# EAGLE schematic PWM (EAGLE 6.2)

## Sheet 1 of 3
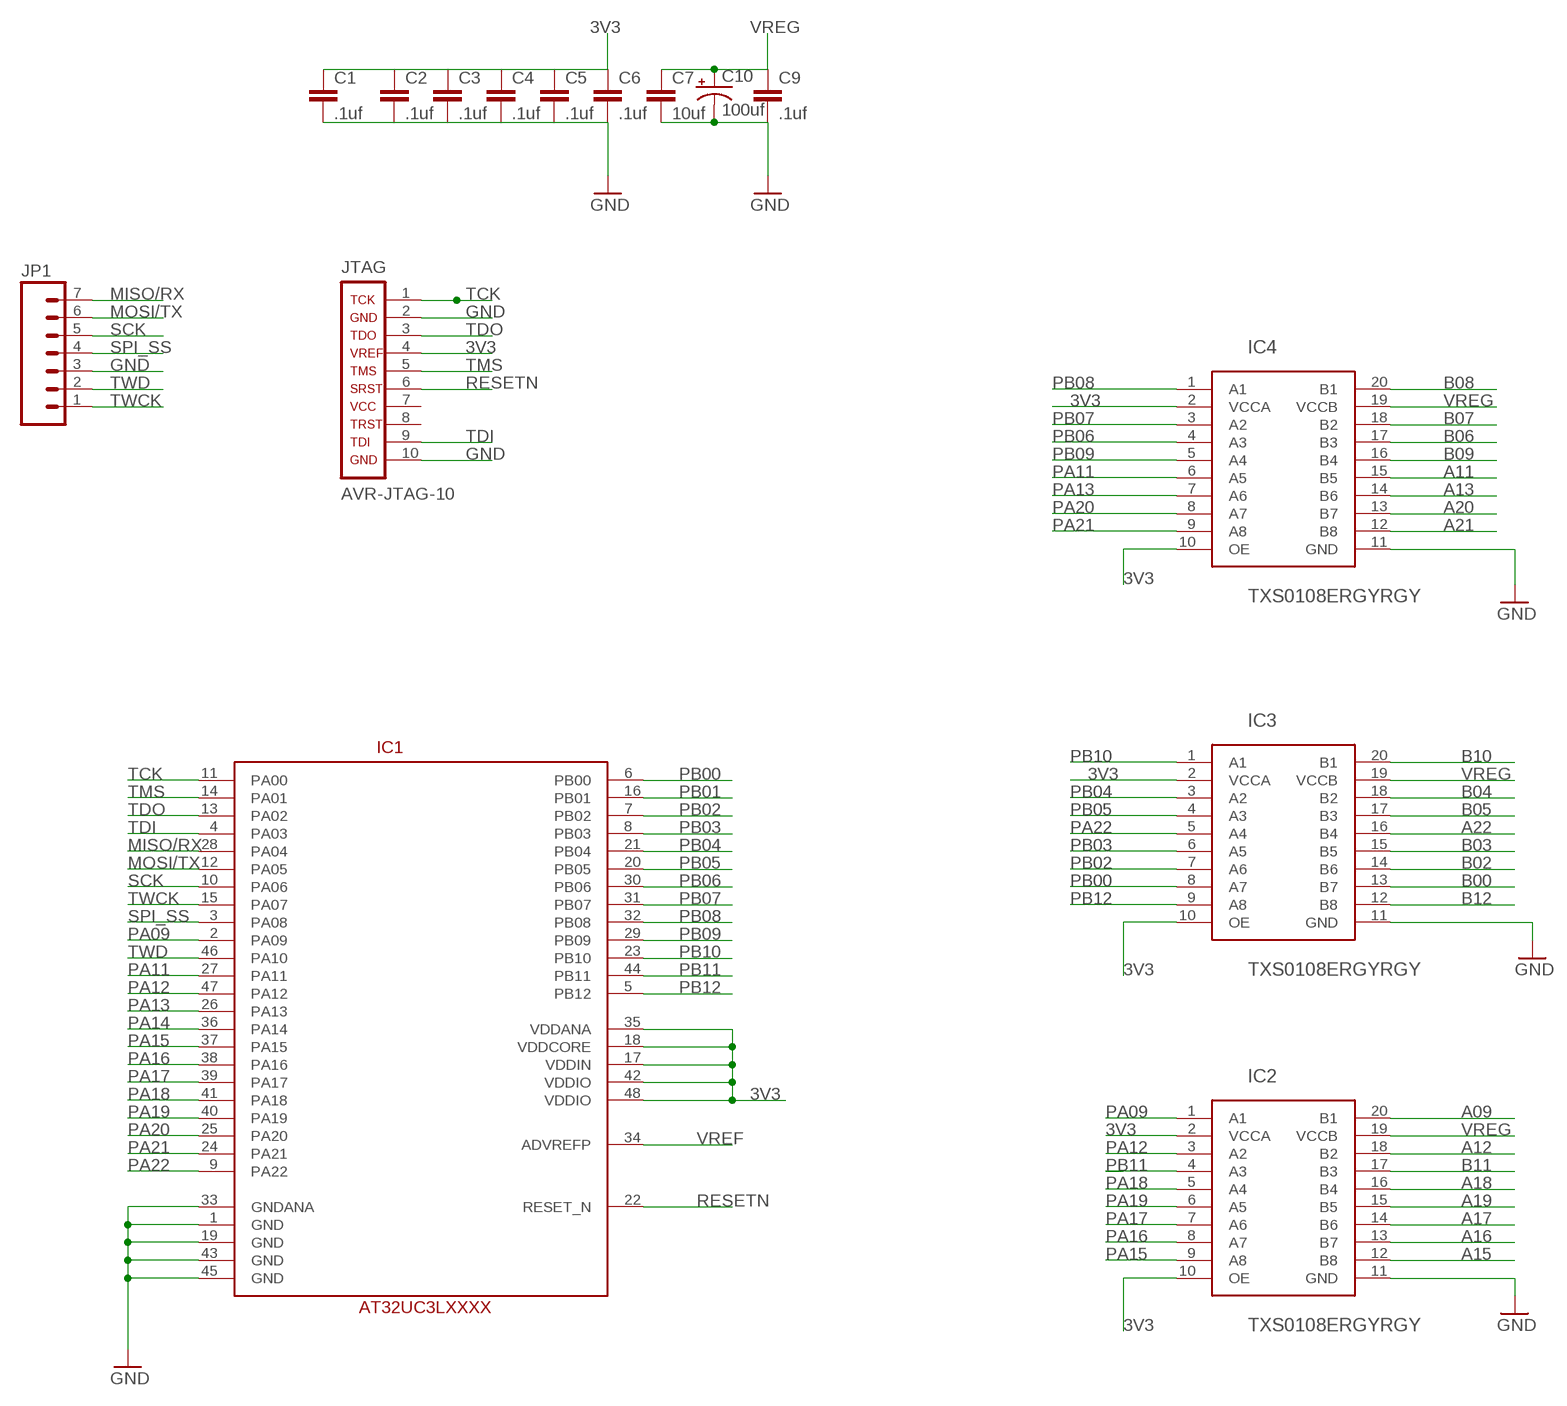
[diagram p0: schematic, sheet 1]

### Parts
C1  .1uf  CAP0805  [0805]
C2  .1uf  CAP0805  [0805]
C3  .1uf  CAP0805  [0805]
C4  .1uf  CAP0805  [0805]
C5  .1uf  CAP0805  [0805]
C6  .1uf  CAP0805  [0805]
C7  10uf  CAP0805  [0805]
C9  .1uf  CAP0805  [0805]
C10  100uf  CAP_POL7343  [EIA7343]
IC1  AT32UC3L016/32/64  [TQFP48]
IC2  TXS0108ERGYRGY  [RGY]
IC3  TXS0108ERGYRGY  [RGY]
IC4  TXS0108ERGYRGY  [RGY]
JP1  M07  [1X07]
JTAG  AVR-JTAG-10  [AVR-JTAG-10]

### Nets
3V3: C1.1 C2.1 C3.1 C4.1 C5.1 C6.1 IC1.17(VDDIN) IC1.18(VDDCORE) IC1.35(VDDANA) IC1.42(VDDIO) IC1.48(VDDIO) IC2.2(VCCA) IC2.10(OE) IC3.2(VCCA) IC3.10(OE) IC4.2(VCCA) IC4.10(OE) JTAG.4 ; also sheet 3
A09: IC2.20(B1) ; also sheet 2
A11: IC4.15(B5) ; also sheet 2
A12: IC2.18(B2) ; also sheet 2
A13: IC4.14(B6) ; also sheet 2
A15: IC2.12(B8) ; also sheet 2
A16: IC2.13(B7) ; also sheet 2
A17: IC2.14(B6) ; also sheet 2
A18: IC2.16(B4) ; also sheet 2
A19: IC2.15(B5) ; also sheet 2
A20: IC4.13(B7) ; also sheet 2
A21: IC4.12(B8) ; also sheet 2
A22: IC3.16(B4) ; also sheet 2
B00: IC3.13(B7) ; also sheet 2
B02: IC3.14(B6) ; also sheet 2
B03: IC3.15(B5) ; also sheet 2
B04: IC3.18(B2) ; also sheet 2
B05: IC3.17(B3) ; also sheet 2
B06: IC4.17(B3) ; also sheet 2
B07: IC4.18(B2) ; also sheet 2
B08: IC4.20(B1) ; also sheet 2
B09: IC4.16(B4) ; also sheet 2
B10: IC3.20(B1) ; also sheet 2
B11: IC2.17(B3) ; also sheet 2
B12: IC3.12(B8) ; also sheet 2
GND: C1.2 C2.2 C3.2 C4.2 C5.2 C6.2 C7.2 C9.2 C10.C(-) IC1.1(GND) IC1.19(GND) IC1.33(GNDANA) IC1.43(GND) IC1.45(GND) IC2.11(GND) IC3.11(GND) IC4.11(GND) JP1.3 JTAG.2 JTAG.10 ; also sheet 2,3
MISO/RX: IC1.28(PA04) JP1.7
MOSI/TX: IC1.12(PA05) JP1.6
PA09: IC1.2(PA09) IC2.1(A1)
PA11: IC1.27(PA11) IC4.6(A5)
PA12: IC1.47(PA12) IC2.3(A2)
PA13: IC1.26(PA13) IC4.7(A6)
PA14: IC1.36(PA14)
PA15: IC1.37(PA15) IC2.9(A8)
PA16: IC1.38(PA16) IC2.8(A7)
PA17: IC1.39(PA17) IC2.7(A6)
PA18: IC1.41(PA18) IC2.5(A4)
PA19: IC1.40(PA19) IC2.6(A5)
PA20: IC1.25(PA20) IC4.8(A7)
PA21: IC1.24(PA21) IC4.9(A8)
PA22: IC1.9(PA22) IC3.5(A4)
PB00: IC1.6(PB00) IC3.8(A7)
PB01: IC1.16(PB01)
PB02: IC1.7(PB02) IC3.7(A6)
PB03: IC1.8(PB03) IC3.6(A5)
PB04: IC1.21(PB04) IC3.3(A2)
PB05: IC1.20(PB05) IC3.4(A3)
PB06: IC1.30(PB06) IC4.4(A3)
PB07: IC1.31(PB07) IC4.3(A2)
PB08: IC1.32(PB08) IC4.1(A1)
PB09: IC1.29(PB09) IC4.5(A4)
PB10: IC1.23(PB10) IC3.1(A1)
PB11: IC1.44(PB11) IC2.4(A3)
PB12: IC1.5(PB12) IC3.9(A8)
RESETN: IC1.22(RESET_N) JTAG.6
SCK: IC1.10(PA06) JP1.5
SPI_SS: IC1.3(PA08) JP1.4
TCK: IC1.11(PA00) JTAG.1
TDI: IC1.4(PA03) JTAG.9
TDO: IC1.13(PA02) JTAG.3
TMS: IC1.14(PA01) JTAG.5
TWCK: IC1.15(PA07) JP1.1
TWD: IC1.46(PA10) JP1.2
VREF: IC1.34(ADVREFP)
VREG: C7.1 C9.1 C10.A(+) IC2.19(VCCB) IC3.19(VCCB) IC4.19(VCCB) ; also sheet 2,3
Unconnected: JTAG.7 JTAG.8

## Sheet 2 of 3
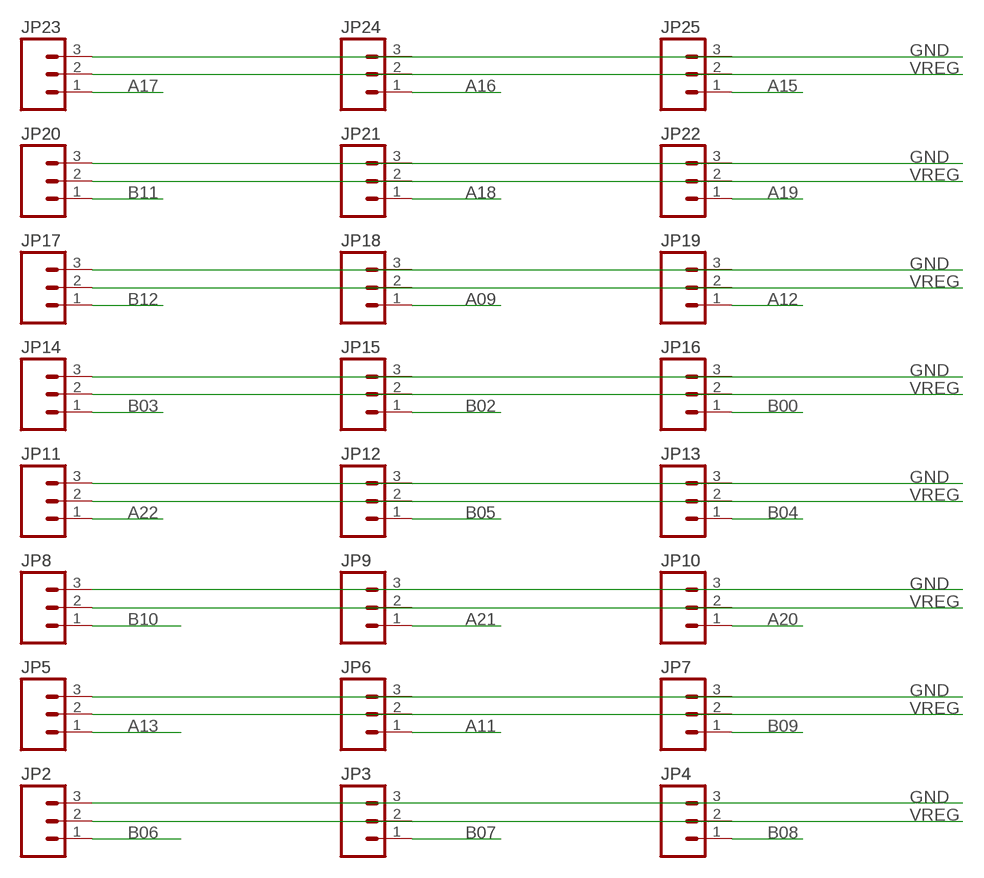
[diagram p1: schematic, sheet 2]

### Parts
JP2  M03PTH  [1X03]
JP3  M03PTH  [1X03]
JP4  M03PTH  [1X03]
JP5  M03PTH  [1X03]
JP6  M03PTH  [1X03]
JP7  M03PTH  [1X03]
JP8  M03PTH  [1X03]
JP9  M03PTH  [1X03]
JP10  M03PTH  [1X03]
JP11  M03PTH  [1X03]
JP12  M03PTH  [1X03]
JP13  M03PTH  [1X03]
JP14  M03PTH  [1X03]
JP15  M03PTH  [1X03]
JP16  M03PTH  [1X03]
JP17  M03PTH  [1X03]
JP18  M03PTH  [1X03]
JP19  M03PTH  [1X03]
JP20  M03PTH  [1X03]
JP21  M03PTH  [1X03]
JP22  M03PTH  [1X03]
JP23  M03PTH  [1X03]
JP24  M03PTH  [1X03]
JP25  M03PTH  [1X03]

### Nets
A09: JP18.1 ; also sheet 1
A11: JP6.1 ; also sheet 1
A12: JP19.1 ; also sheet 1
A13: JP5.1 ; also sheet 1
A15: JP25.1 ; also sheet 1
A16: JP24.1 ; also sheet 1
A17: JP23.1 ; also sheet 1
A18: JP21.1 ; also sheet 1
A19: JP22.1 ; also sheet 1
A20: JP10.1 ; also sheet 1
A21: JP9.1 ; also sheet 1
A22: JP11.1 ; also sheet 1
B00: JP16.1 ; also sheet 1
B02: JP15.1 ; also sheet 1
B03: JP14.1 ; also sheet 1
B04: JP13.1 ; also sheet 1
B05: JP12.1 ; also sheet 1
B06: JP2.1 ; also sheet 1
B07: JP3.1 ; also sheet 1
B08: JP4.1 ; also sheet 1
B09: JP7.1 ; also sheet 1
B10: JP8.1 ; also sheet 1
B11: JP20.1 ; also sheet 1
B12: JP17.1 ; also sheet 1
GND: JP2.3 JP3.3 JP4.3 JP5.3 JP6.3 JP7.3 JP8.3 JP9.3 JP10.3 JP11.3 JP12.3 JP13.3 JP14.3 JP15.3 JP16.3 JP17.3 JP18.3 JP19.3 JP20.3 JP21.3 JP22.3 JP23.3 JP24.3 JP25.3 ; also sheet 1,3
VREG: JP2.2 JP3.2 JP4.2 JP5.2 JP6.2 JP7.2 JP8.2 JP9.2 JP10.2 JP11.2 JP12.2 JP13.2 JP14.2 JP15.2 JP16.2 JP17.2 JP18.2 JP19.2 JP20.2 JP21.2 JP22.2 JP23.2 JP24.2 JP25.2 ; also sheet 1,3

## Sheet 3 of 3
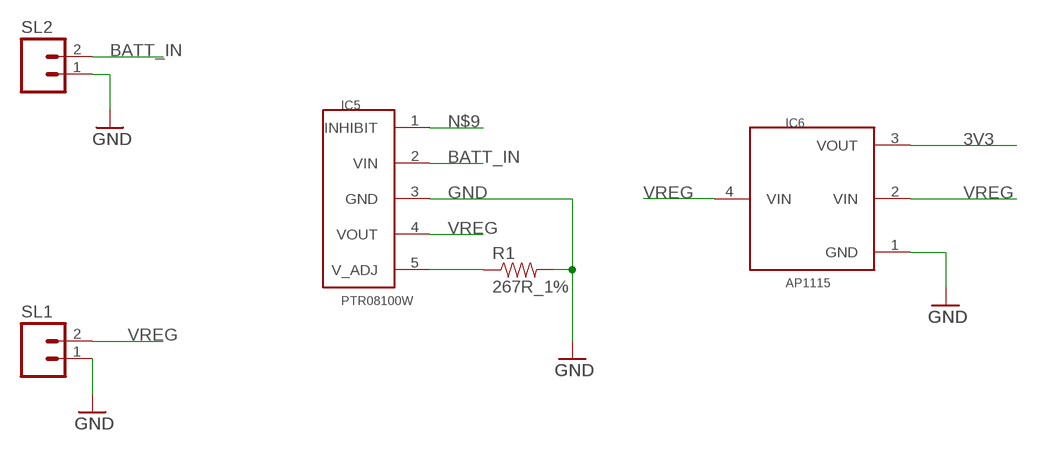
[diagram p2: schematic, sheet 3]

### Parts
IC5  PTR08100W  SLTS284ETI  [SLTS284E]
IC6  AP1115  [SOT89-3L]
R1  267R_1%  RESISTOR0805-RES  [0805]
SL1  M02  [02P]
SL2  M02  [02P]

### Nets
3V3: IC6.3(VOUT) ; also sheet 1
BATT_IN: IC5.2(VIN) SL2.2
GND: IC5.3(GND) IC6.1(GND) R1.2 SL1.1 SL2.1 ; also sheet 1,2
N$5: IC5.5(V_ADJ) R1.1
N$9: IC5.1(INHIBIT)
VREG: IC5.4(VOUT) IC6.2(VIN) IC6.4(VIN) SL1.2 ; also sheet 1,2

## Library data of the parts
C1-C7 C9 = SparkFun:CAP: Capacitor Standard 0603 ceramic capacitor, and 0.1" leaded capacitor.
C10 = SparkFun:CAP_POL: Capacitor Polarized These are standard SMD and PTH capacitors. Normally 10uF, 47uF, and 100uF in electrolytic and tantalum varieties. Always verify the external diameter of the through hole cap, it varies with capacity, voltage, and manufacturer. The EIA devices should be standard.
IC1 = atmel-avr32-michel:AT32UC3L016/32/64: AT32UC3L016/32/64 Low power AVR32 device
IC2-IC4 = PWM:TXS0108E
IC5 = PWM:SLTS284E
IC6 = PWM:AP1115
JP1 = SparkFun:M07: Header 7 Standard 7-pin 0.1" header. Use with straight break away headers (SKU : PRT-00116), right angle break away headers (PRT-00553), swiss pins (PRT-00743), machine pins (PRT-00117), and female headers (PRT-00115). NOTES ON THE VARIANTS LOCK and LOCK_LONGPADS... This footprint was designed to help hold the alignment of a through-hole component (i.e. 7-pin header) while soldering it into place. You may notice that each hole has been shifted either up or down by 0.005 of an inch from it's more standard position (which is usually a perfectly straight line). This slight alteration caused the pins (the squares in the middle) to touch the edges of the holes. Because they are alternating, it causes a "brace" to hold the header in place. 0.005 has proven to be the perfect amount of "off-center" position when using our standard breakaway headers. Although looks a little odd when you look at the bare footprint, once you have a header in there, the alteration is very hard to notice. Also, if you push a header all the way into place, it is covered up entirely on the bottom side. This idea of altering the position of holes to aid alignment will be further integrated into the Sparkfun Library for other footprints. It can help hold any component with 3 or more connection pins.
JP2-JP25 = Speaker_shield:M03: Header 3 Standard 3-pin 0.1" header. Use with straight break away headers (SKU : PRT-00116), right angle break away headers (PRT-00553), swiss pins (PRT-00743), machine pins (PRT-00117), and female headers (PRT-00115). Molex polarized connector foot print use with SKU : PRT-08232 with associated crimp pins and housings.
JTAG = atmel-avr32-michel:AVR-JTAG-10: AVR JTAG Debug/Programming Header
R1 = SparkFun:RESISTOR: Resistor Basic schematic elements and footprints for 0603, 1206, and PTH resistors.
SL1 SL2 = con-amp-quick:M02: AMP QUICK CONNECTOR; OC_FARNELL: unknown; OC_NEWARK: unknown